# EAGLE design tempsensor (EAGLE 7.4.0)
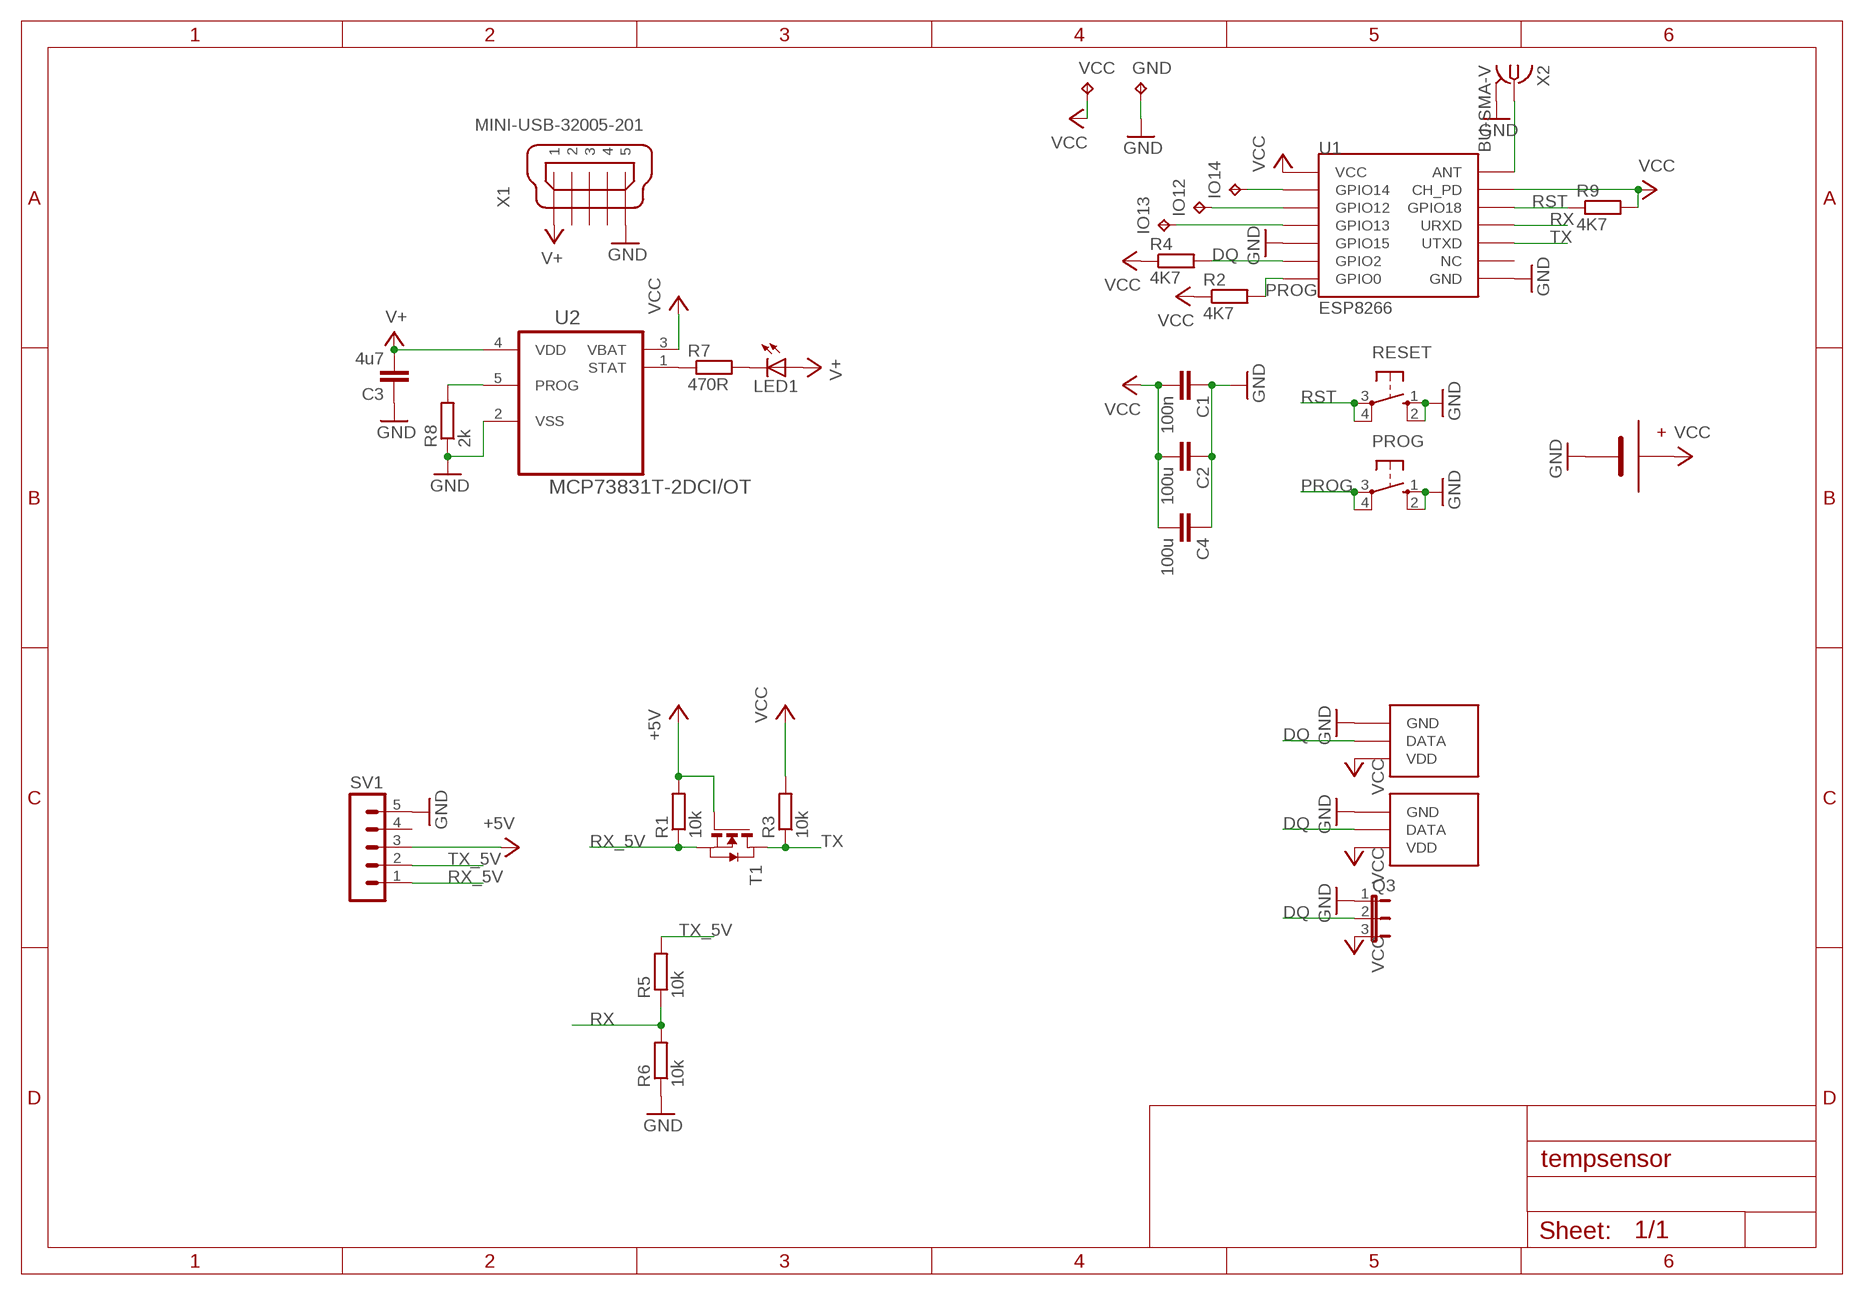
[diagram p0: schematic, sheet 1]

## Parts
C1  100n  C-EUC0805  [C0805]
C2  100u  C-EUC1206  [C1206]
C3  4u7  C-EUC0805  [C0805]
C4  100u  C-EUC1206  [C1206]
GND  TPPAD1-13  [P1-13]
IO12  TPPAD1-13  [P1-13]
IO13  TPPAD1-13  [P1-13]
IO14  TPPAD1-13  [P1-13]
LED1  LEDCHIPLED_0805  [CHIPLED_0805]
PROG  10-XX  [B3F-10XX]
Q1  DS18X20TO92  [TO92]
Q2  DS18X20SO-8  [SO08WIDE]
Q3  JP2E  [JP2]
R1  10k  R-EU_M0805  [M0805]
R2  4K7  R-EU_M0805  [M0805]
R3  10k  R-EU_M0805  [M0805]
R4  4K7  R-EU_M0805  [M0805]
R5  10k  R-EU_M0805  [M0805]
R6  10k  R-EU_M0805  [M0805]
R7  470R  R-EU_M0805  [M0805]
R8  2k  R-EU_M0805  [M0805]
R9  4K7  R-EU_M0805  [M0805]
RESET  10-XX  [B3F-10XX]
SV1  MA05-1  [MA05-1]
T1  NMOSSOT23  [SOT-23]
U1  ESP8266  [ESP-03]
U2  MCP73831T-2DCI/OT  [SOT95P270X145-5N]
U$2  18650-BATTERHOLDERHA1X18650  [HA1X18650]
VCC  TPPAD1-13  [P1-13]
X1  MINI-USB-32005-201  [32005-201]
X2  BU-SMA-V  [BU-SMA-V]

## Nets
+5V: R1.2 SV1.3 T1.3(G)
DQ: Q1.2(DATA) Q2.4(DATA) Q3.2 R4.2 U1.GPIO2
GND: C1.1 C2.1 C3.1 C4.1 GND.TP PROG.1(S) PROG.2(S1) Q1.3(GND) Q2.5(GND) Q3.1 R6.1 R8.1 RESET.1(S) RESET.2(S1) SV1.5 U1.GND U1.GPIO15 U2.2(VSS) U$2.P$1 X1.5 X2.2 X2.3 X2.4 X2.5
N$1: R7.1 U2.1(STAT)
N$2: IO13.TP U1.GPIO13
N$3: IO12.TP U1.GPIO12
N$4: IO14.TP U1.GPIO14
N$5: LED1.C R7.2
N$6: R8.2 U2.5(PROG)
N$7: U1.ANT X2.1
PROG: PROG.3(P) PROG.4(P1) R2.2 U1.GPIO0
RST: R9.1 RESET.3(P) RESET.4(P1) U1.GPIO18
RX: R5.1 R6.2 U1.URXD
RX_5V: R1.1 SV1.1 T1.2(S)
TX: R3.1 T1.1(D) U1.UTXD
TX_5V: R5.2 SV1.2
V+: C3.2 LED1.A U2.4(VDD) X1.1
VCC: C1.2 C2.2 C4.2 Q1.1(VDD) Q2.3(VDD) Q3.3 R2.1 R3.2 R4.1 R9.2 U1.CH_PD U1.VCC U2.3(VBAT) U$2.P$2 VCC.TP
Unconnected: SV1.4 U1.NC X1.2 X1.3 X1.4

## Library data of the parts
C1-C4 = resistor:C-EU: CAPACITOR, European symbol
GND IO12-IO14 VCC = testpad:TP: Test pad
LED1 = led:LED: LED OSRAM: - CHIPLED LG R971, LG N971, LY N971, LG Q971, LY Q971, LO R971, LY R971 LH N974, LH R974 LS Q976, LO Q976, LY Q976 LO Q996 - Hyper CHIPLED LW Q18S LB Q993, LB Q99A, LB R99A - SideLED LS A670, LO A670, LY A670, LG A670, LP A670 LB A673, LV A673, LT A673, LW A673 LH A674 LY A675 LS A676, LA A676, LO A676, LY A676, LW A676 LS A679, LY A679, LG A679 - Hyper Micro SIDELED® LS Y876, LA Y876, LO Y876, LY Y876 LT Y87S - SmartLED LW L88C, LW L88S LB L89C, LB L89S, LG L890 LS L89K, LO L89K, LY L89K LS L896, LA L896, LO L896, LY L896 - TOPLED LS T670, LO T670, LY T670, LG T670, LP T670 LSG T670, LSP T670, LSY T670, LOP T670, LYG T670 LG T671, LOG T671, LSG T671 LB T673, LV T673, LT T673, LW T673 LH T674 LS T676, LA T676, LO T676, LY T676, LB T676, LH T676, LSB T676, LW T676 LB T67C, LV T67C, LT T67C, LS T67K, LO T67K, LY T67K, LW E67C LS E67B, LA E67B, LO E67B, LY E67B, LB E67C, LV E67C, LT E67C LW T67C LS T679, LY T679, LG T679 LS T770, LO T770, LY T770, LG T770, LP T770 LB T773, LV T773, LT T773, LW T773 LH T774 LS E675, LA E675, LY E675, LS T675 LS T776, LA T776, LO T776, LY T776, LB T776 LHGB T686 LT T68C, LB T68C - Hyper Mini TOPLED® LB M676 - Mini TOPLED Santana® LG M470 LS M47K, LO M47K, LY M47K Source: http://www.osram.convergy.de LUXEON: - LUMILED® LXK2-PW12-R00, LXK2-PW12-S00, LXK2-PW14-U00, LXK2-PW14-V00 LXK2-PM12-R00, LXK2-PM12-S00, LXK2-PM14-U00 LXK2-PE12-Q00, LXK2-PE12-R00, LXK2-PE12-S00, LXK2-PE14-T00, LXK2-PE14-U00 LXK2-PB12-K00, LXK2-PB12-L00, LXK2-PB12-M00, LXK2-PB14-N00, LXK2-PB14-P00, LXK2-PB14-Q00 LXK2-PR12-L00, LXK2-PR12-M00, LXK2-PR14-Q00, LXK2-PR14-R00 LXK2-PD12-Q00, LXK2-PD12-R00, LXK2-PD12-S00 LXK2-PH12-R00, LXK2-PH12-S00 LXK2-PL12-P00, LXK2-PL12-Q00, LXK2-PL12-R00 Source: www.luxeon.com KINGBRIGHT: KA-3528ASYC Source: www.kingbright.com
PROG RESET = switch-omron:10-XX: OMRON SWITCH; MPN: B3F-1000; OC_FARNELL: 176432; OC_NEWARK: 36M3542
Q1 Q2 = ds18x20-board:DS18X20
Q3 = jumper:JP2E: JUMPER
R1-R9 = resistor:R-EU_: RESISTOR, European symbol
SV1 = con-lstb:MA05-1: PIN HEADER; OC_FARNELL: unknown; OC_NEWARK: unknown
T1 = zetex:NMOSSOT23: MOS FET; OC_FARNELL: unknown; OC_NEWARK: unknown
U1 = esp8266modules:ESP8266: ESP8266 Wifi module 03 & 04
U2 = Microchip-MCP73831T-2DCI_OT:MCP73831T-2DCI/OT: Li-Polymer Charge Management Controllers, SOT23-5; MPN: MCP73831T-2DCI/OT; OC_FARNELL: 1840935; OC_NEWARK: 84R6271; PACKAGE: SOT23-5; SUPPLIER: Microchip
U$2 = 18650:18650-BATTERHOLDER
X1 = con-cypressindustries:MINI-USB-: MINI USB-B Conector Source: www.cypressindustries.com; OC_FARNELL: unknown; OC_NEWARK: unknown
X2 = con-coax:BU-SMA-V: FEMALE SMA CONNECTOR Radiall distributor RS 112-3794; OC_FARNELL: unknown; OC_NEWARK: unknown

## Board
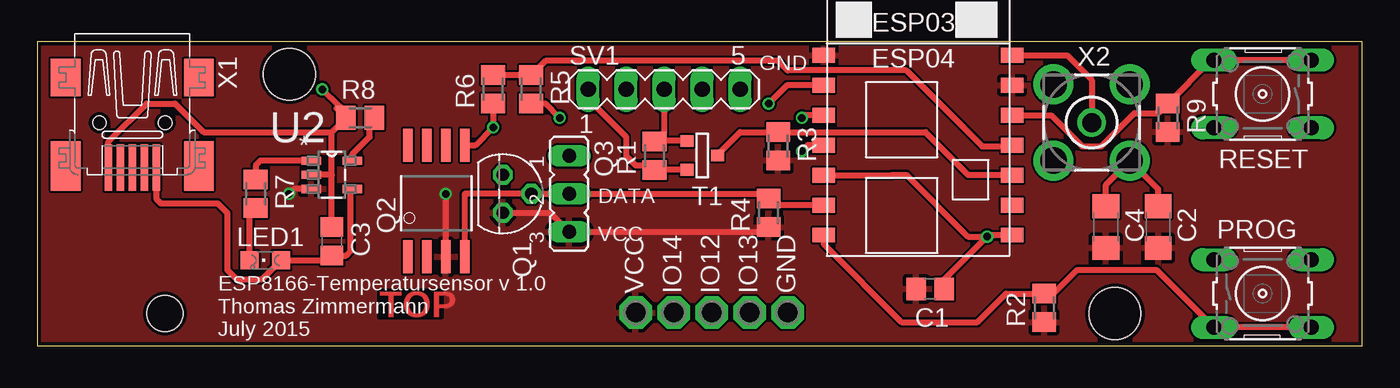
[diagram p1: board, top side]
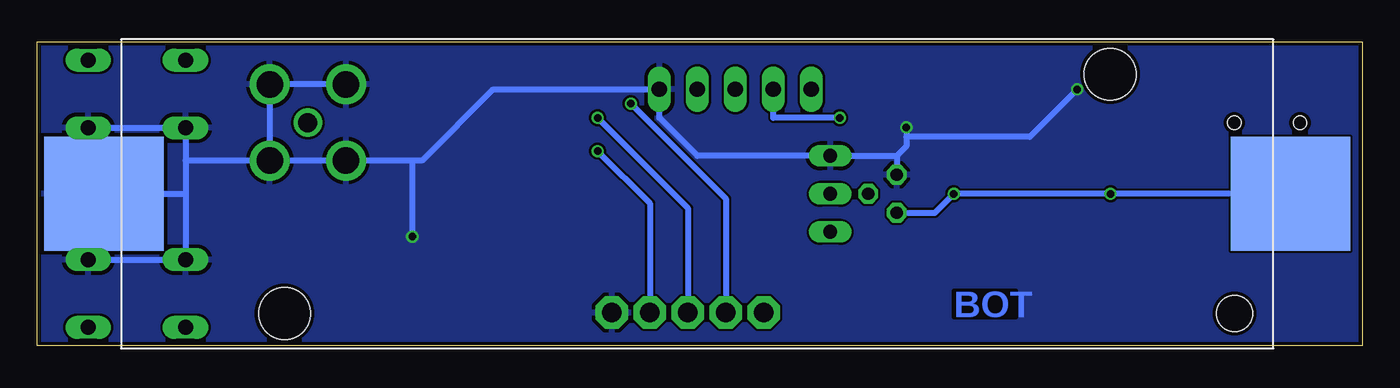
[diagram p2: board, bottom side, seen from below]

Size 88.57 x 20.31 mm. Coordinates in mm from the lower left corner, seen from the top.
Outline: 0,0 88.57,0 88.57,20.31 0,20.31 0,0
Copper layers (1*16): Top 0.035mm / dielectric 1.5mm / Bottom 0.035mm
Design rules "Elecrow_2-layer_eagle_rule": minimum track width 6mil, minimum drill 12mil, track to track 6mil, track to pad 6mil, pad to pad 6mil, via to via 6mil, smd to smd 0mil, copper to edge 10mil, drill to drill 10mil, minimum pad ring 10mil, minimum via ring 6mil, stop-mask expansion 2mil, vias tented up to drill 100mil, thermal gap 10mil

### Footprints (pad centres in the part's own frame; a part is rotated, then mirrored left to right if it is on the bottom)
C0805 = smd 1.3 x 1.5: 1 -0.95,0; 2 0.95,0
C1206 = smd 1.6 x 1.8: 1 -1.4,0; 2 1.4,0
P1-13 = drill 1.321 pad 2.159 octagon: TP 0,0
CHIPLED_0805 = smd 1.2 x 1.2: A 0,-1.05; C 0,1.05
B3F-10XX = drill 1.016 long: 1 -3.251,2.261; 2 3.251,2.261; 3 -3.251,-2.261; 4 3.251,-2.261
TO92 = drill 0.813 octagon: 1 1.27,0; 2 0,1.905; 3 -1.27,0
SO08WIDE = smd 0.61 x 2.21: 1 -1.905,-3.569; 2 -0.635,-3.569; 3 0.635,-3.569; 4 1.905,-3.569; 5 1.905,3.886; 6 0.635,3.886; 7 -0.635,3.886; 8 -1.905,3.886
JP2 = drill 0.914 long: 1 -2.54,0; 2 0,0; 3 2.54,0
M0805 = smd 1.3 x 1.6: 1 -0.95,0; 2 0.95,0
MA05-1 = drill 1.016 long: 1 -5.08,0; 2 -2.54,0; 3 0,0; 4 2.54,0; 5 5.08,0
SOT-23 = smd 0.787 x 0.889: 1 0.025,-1.016; 2 -0.94,1.016; 3 0.991,1.016
ESP-03 = smd 1.5 x 1: ANT 7.4,4.8; CH_PD 7.4,2.8; GND 7.4,-7.2; GPIO0 -5.2,-7.2; GPIO2 -5.2,-5.2; GPIO12 -5.2,0.8; GPIO13 -5.2,-1.2; GPIO14 -5.2,2.8; GPIO15 -5.2,-3.2; GPIO18 7.4,0.8; NC 7.4,-5.2; URXD 7.4,-1.2; UTXD 7.4,-3.2; VCC -5.2,4.8
SOT95P270X145-5N = smd 1.321 x 0.559: 1 -1.372,0.94; 2 -1.372,0; 3 -1.372,-0.94; 4 1.372,-0.94; 5 1.372,0.94
HA1X18650 = smd 7.62 x 8: P$1 0,39.66; P$2 0,-39.66 | hole 2.4: -8,-35.93 | hole 3.45: 8,-27.6; -8,27.6
32005-201 = smd 3.1 x 0.5: 1 3,1.6; 2 3,0.8; 3 3,0; 4 3,-0.8; 5 3,-1.6 | smd 2.5 x 2: M1 -3,-4.45; M2 -3,4.45 | smd 3.3 x 2: M3 2.9,4.45; M4 2.9,-4.45 | hole 0.9: 0,2.2; 0,-2.2
BU-SMA-V = drill 1.27: 1 0,0 | drill 1.778: 2 -2.55,2.55; 3 2.55,2.55; 4 2.55,-2.55; 5 -2.55,-2.55

### Placement (x,y rotation side)
C1  59.69,3.81 180 top
C2  74.93,7.94 270 top
C3  19.68,6.99 270 top
C4  71.44,7.94 270 top
GND  50.16,2.22 180 top
IO12  45.09,2.22 0 top
IO13  47.62,2.22 0 top
IO14  42.55,2.22 0 top
LED1  15.24,5.71 90 top
PROG  81.92,3.49 0 top
Q1  31.11,10.16 270 top
Q2  26.67,9.53 0 top
Q3  35.56,10.16 270 top
R1  41.27,12.7 90 top
R2  67.31,2.54 90 top
R3  49.53,13.34 270 top
R4  48.9,8.89 90 top
R5  33.02,17.14 270 top
R6  30.48,17.14 90 top
R7  14.61,10.16 270 top
R8  21.59,15.24 0 top
R9  75.56,15.24 270 top
RESET  81.92,16.83 180 top
SV1  41.91,17.14 0 top
T1  44.45,12.7 90 top
U1  57.78,14.61 0 top
U2  19.68,11.43 0 top
U$2  44.45,10.16 90 bottom
VCC  40.01,2.22 0 top
X1  6.35,14.92 270 top
X2  70.48,14.92 0 top

### Tracks (layer width: path | path; a pad name or v marks a point on that pad's centre or on a via)
+5V
  Top 0.406: SV1.3 41.91,14.29 R1.2 41.32,13.69 T1.3
DQ
  Top 0.406: Q2.4 28.57,10.16 Q1.2 Q3.2 48.58,10.16 R4.2 49.33,9.4 U1.GPIO2
GND  (via drill 0.5)
  Top 0.406: R6.1 v30.48,14.61 29.29,13.41 Q2.5 | C3.1 19.68,11.43 | 19.68,11.43 U2.2 | 19.68,11.43 19.68,14.29 | 19.68,14.29 11.11,14.29 9.21,16.19 7.3,16.19 4.75,13.64 X1.5 | 19.68,14.29 R8.1 20.64,15.55 20.16,16.03 | 20.16,16.03 v19.05,17.14 | 20,15.88 20.16,16.03 | U1.GND 63.72,7.41 v63.5,7.3 | U1.GPIO15 57.12,11.4 57.15,11.43 58.1,11.43 62.23,7.3 v63.5,7.3 | C4.1 71.44,10.78 X2.4 74.93,10.48 C2.1 | C1.1 60.64,4.44 v63.5,7.3
  Bottom 0.406: 31.11,12.7 Q3.1 44.45,12.7 46.99,15.24 SV1.5 58.1,17.14 62.87,12.38 63.5,12.38 | 31.11,12.7 Q1.3 | v30.48,14.61 30.48,13.97 | 30.48,13.97 30.48,13.34 31.11,12.7 | 30.48,13.97 22.23,13.97 v19.05,17.14 | 78.66,12.38 RESET.2 RESET.1 | PROG.2 PROG.1 78.66,10.16 | 63.5,12.38 66.99,12.38 X2.5 X2.4 | X2.2 X2.3 X2.4 | X2.4 78.65,12.37 78.66,12.38 | 78.66,12.38 78.66,10.16 | U$2.P$1 78.66,10.16 | v63.5,7.3 63.5,12.38
  pour Bottom: 0,20.32 0,0 88.9,0 88.9,20.32
N$1
  Top 0.406: U2.1 14.91,12.37 14.61,12.06 R7.1
N$2  (via drill 0.5)
  Top 0.406: U1.GPIO13 51.51,13.4 v51.12,13.02
  Bottom 0.406: v51.12,13.02 47.62,9.53 IO13.TP
N$3  (via drill 0.5)
  Top 0.406: U1.GPIO12 51.28,15.4 v51.12,15.24
  Bottom 0.406: v51.12,15.24 45.09,9.21 45.09,2.54 IO12.TP
N$4  (via drill 0.5)
  Top 0.406: U1.GPIO14 50.11,17.41 v48.9,16.19
  Bottom 0.406: v48.9,16.19 42.55,9.84 IO14.TP
N$5
  Top 0.406: LED1.C 14.19,8.79 R7.2
N$6
  Top 0.406: U2.5 21.06,12.8 22.23,13.97 22.23,14.93 R8.2
N$7
  Top 0.406: U1.ANT 68.86,19.41 70.48,17.78 X2.1
PROG
  Top 0.406: PROG.4 PROG.3 74.82,5.08 69.53,5.08 67.94,3.49 R2.2 64.77,3.49 62.87,1.59 57.78,1.59 52.59,6.79 U1.GPIO0
RST
  Top 0.406: RESET.3 RESET.4 78.46,19.09 R9.1 74.93,15.56 73.34,15.56 71.12,13.34 69.85,13.34 67.78,15.4 U1.GPIO18
RX
  Top 0.406: R6.2 R5.1 33.98,19.05 49.53,19.05 50.16,18.41 58.1,18.41 63.18,13.34 65.11,13.34 U1.URXD
RX_5V
  Top 0.406: T1.2 41.28,11.76 R1.1 40.96,12.06 40.01,12.06 39.37,12.7 39.37,13.97 36.83,16.51 SV1.1
TX
  Top 0.406: 45.47,12.63 T1.1 45.47,12.76 46.99,14.29 R3.1 59.38,14.29 62.23,11.43 65.16,11.43 U1.UTXD
TX_5V  (via drill 0.5)
  Top 0.406: R5.2 33.97,16.2 v34.92,15.24
  Bottom 0.406: v34.92,15.24 39.37,15.24 SV1.2
V+
  Top 0.406: U2.4 20.95,10.39 20.95,6.35 20.64,6.04 C3.2 19.36,5.71 LED1.A 15.02,4.45 13.34,4.45 12.7,5.08 12.7,8.89 12.06,9.53 8.26,9.53 7.95,9.83 X1.1
VCC  (via drill 0.5)
  Top 0.406: 67.63,1.27 R2.1 | v27.3,10.16 Q2.3 | Q1.1 34.29,8.89 Q3.3 48.58,7.62 R4.1 | U2.3 17.16,10.49 v16.83,10.16
  Bottom 0.406: U$2.P$2 v16.83,10.16 v27.3,10.16 28.57,8.89 Q1.1
  pour Top: 0,20.32 0,0 88.27,0 88.27,20.32

### Text on the board
Top: TOP
Bottom: BOT
tNames: GND | DATA | VCC | ESP8166-Temperatursensor v 1.0 / Thomas Zimmermann / July 2015